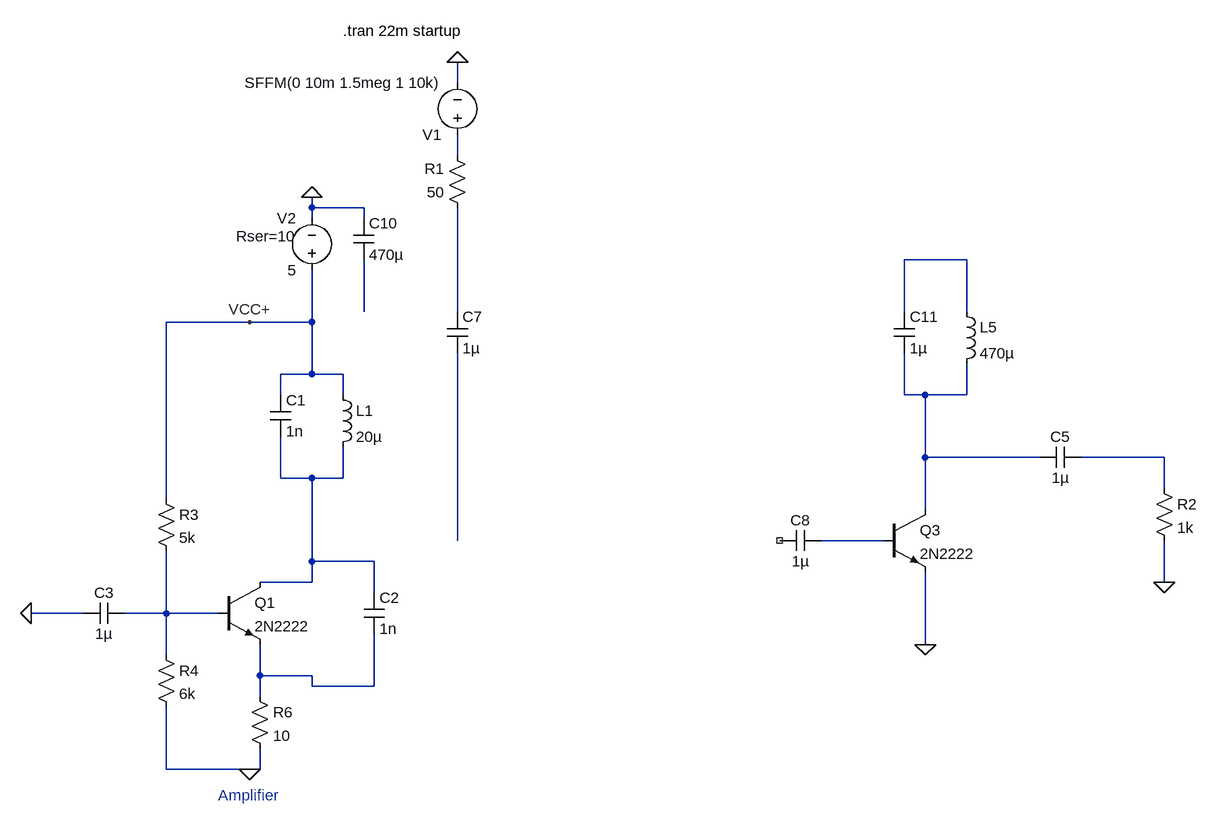
[diagram p0: schematic mixer-demod.asc]
mixer-demod.asc, the LTspice schematic file:
Version 4
SHEET 1 1796 888
WIRE 416 -800 416 -832
WIRE 416 -688 416 -720
WIRE 192 -608 192 -624
WIRE 272 -608 192 -608
WIRE 192 -592 192 -608
WIRE 272 -592 272 -608
WIRE 1200 -528 1104 -528
WIRE 272 -448 272 -528
WIRE 416 -448 416 -608
WIRE 1104 -448 1104 -528
WIRE 1200 -448 1200 -528
WIRE 96 -432 -32 -432
WIRE 192 -432 192 -512
WIRE 192 -432 96 -432
WIRE 192 -352 192 -432
WIRE 192 -352 144 -352
WIRE 240 -352 192 -352
WIRE 144 -320 144 -352
WIRE 240 -320 240 -352
WIRE 1104 -320 1104 -384
WIRE 1136 -320 1104 -320
WIRE 1200 -320 1200 -368
WIRE 1200 -320 1136 -320
WIRE 1136 -224 1136 -320
WIRE 1312 -224 1136 -224
WIRE 1504 -224 1376 -224
WIRE 144 -192 144 -256
WIRE 192 -192 144 -192
WIRE 240 -192 240 -240
WIRE 240 -192 192 -192
WIRE 1504 -176 1504 -224
WIRE -32 -160 -32 -432
WIRE 1136 -144 1136 -224
WIRE 416 -96 416 -384
WIRE 1072 -96 976 -96
WIRE 192 -64 192 -192
WIRE 288 -64 192 -64
WIRE 192 -32 192 -64
WIRE 192 -32 112 -32
WIRE 1504 -32 1504 -96
WIRE 288 -16 288 -64
WIRE -160 16 -240 16
WIRE -32 16 -32 -80
WIRE -32 16 -96 16
WIRE 48 16 -32 16
WIRE 1136 64 1136 -48
WIRE -32 80 -32 16
WIRE 112 112 112 64
WIRE 192 112 112 112
WIRE 192 128 192 112
WIRE 288 128 288 48
WIRE 288 128 192 128
WIRE 112 144 112 112
WIRE -32 256 -32 160
WIRE 96 256 -32 256
WIRE 112 256 112 224
WIRE 112 256 96 256
FLAG 416 -832 0
FLAG 96 256 0
FLAG 96 -432 VCC+
FLAG 192 -624 0
FLAG 1136 64 0
FLAG 1504 -32 0
FLAG -240 16 0
SYMBOL cap 128 -320 R0
SYMATTR InstName C1
SYMATTR Value 1n
SYMBOL ind 224 -336 R0
SYMATTR InstName L1
SYMATTR Value 20µ
SYMBOL voltage 416 -704 R180
WINDOW 123 0 0 Left 0
WINDOW 39 0 0 Left 0
SYMATTR InstName V1
SYMATTR Value SFFM(0 10m 1.5meg 1 10k)
SYMBOL res 432 -592 R180
WINDOW 0 36 76 Left 2
WINDOW 3 36 40 Left 2
SYMATTR InstName R1
SYMATTR Value 50
SYMBOL res -48 -176 R0
SYMATTR InstName R3
SYMATTR Value 5k
SYMBOL res -48 64 R0
SYMATTR InstName R4
SYMATTR Value 6k
SYMBOL cap -96 0 R90
WINDOW 0 0 32 VBottom 2
WINDOW 3 32 32 VTop 2
SYMATTR InstName C3
SYMATTR Value 1µ
SYMBOL npn 48 -32 R0
SYMATTR InstName Q1
SYMATTR Value 2N2222
SYMBOL voltage 192 -496 R180
WINDOW 0 24 96 Left 2
WINDOW 3 24 16 Left 2
WINDOW 123 0 0 Left 0
WINDOW 39 24 68 Left 2
SYMATTR InstName V2
SYMATTR Value 5
SYMATTR SpiceLine Rser=10
SYMBOL res 96 128 R0
SYMATTR InstName R6
SYMATTR Value 10
SYMBOL cap 256 -592 R0
SYMATTR InstName C10
SYMATTR Value 470µ
SYMBOL npn 1072 -144 R0
SYMATTR InstName Q3
SYMATTR Value 2N2222
SYMBOL cap 1088 -448 R0
SYMATTR InstName C11
SYMATTR Value 1µ
SYMBOL ind 1184 -464 R0
SYMATTR InstName L5
SYMATTR Value 470µ
SYMBOL res 1488 -192 R0
SYMATTR InstName R2
SYMATTR Value 1k
SYMBOL cap 1376 -240 R90
WINDOW 0 0 32 VBottom 2
WINDOW 3 32 32 VTop 2
SYMATTR InstName C5
SYMATTR Value 1µ
SYMBOL cap 976 -112 R90
WINDOW 0 0 32 VBottom 2
WINDOW 3 32 32 VTop 2
SYMATTR InstName C8
SYMATTR Value 1µ
SYMBOL cap 400 -448 R0
SYMATTR InstName C7
SYMATTR Value 1µ
SYMBOL cap 272 -16 R0
SYMATTR InstName C2
SYMATTR Value 1n
TEXT 424 -880 Right 2 !.tran 22m startup
TEXT 48 296 Left 2 ;Amplifier

The netlist it stands for:
* mixer-demod.asc
C1 VCC+ N007 1n
L1 VCC+ N007 20µ
V1 N001 0 SFFM(0 10m 1.5meg 1 10k)
R1 N004 N001 50
R3 VCC+ N010 5k
R4 N010 0 6k
C3 N010 0 1µ
Q1 N007 N010 N011 0 2N2222
V2 VCC+ 0 5 Rser=10
R6 N011 0 10
C10 0 N003 470µ
Q3 N005 N009 0 0 2N2222
C11 N002 N005 1µ
L5 N002 N005 470µ
R2 N006 0 1k
C5 N006 N005 1µ
C8 N009 NC_01 1µ
C7 N004 N008 1µ
C2 N007 N011 1n
.model NPN NPN
.model PNP PNP
.lib standard.bjt
.tran 22m startup
* Amplifier
.backanno
.end